# Altium schematic sheet fpga_vq100.SchDoc
size A; SheetNumber: 2; SheetTotal: 2
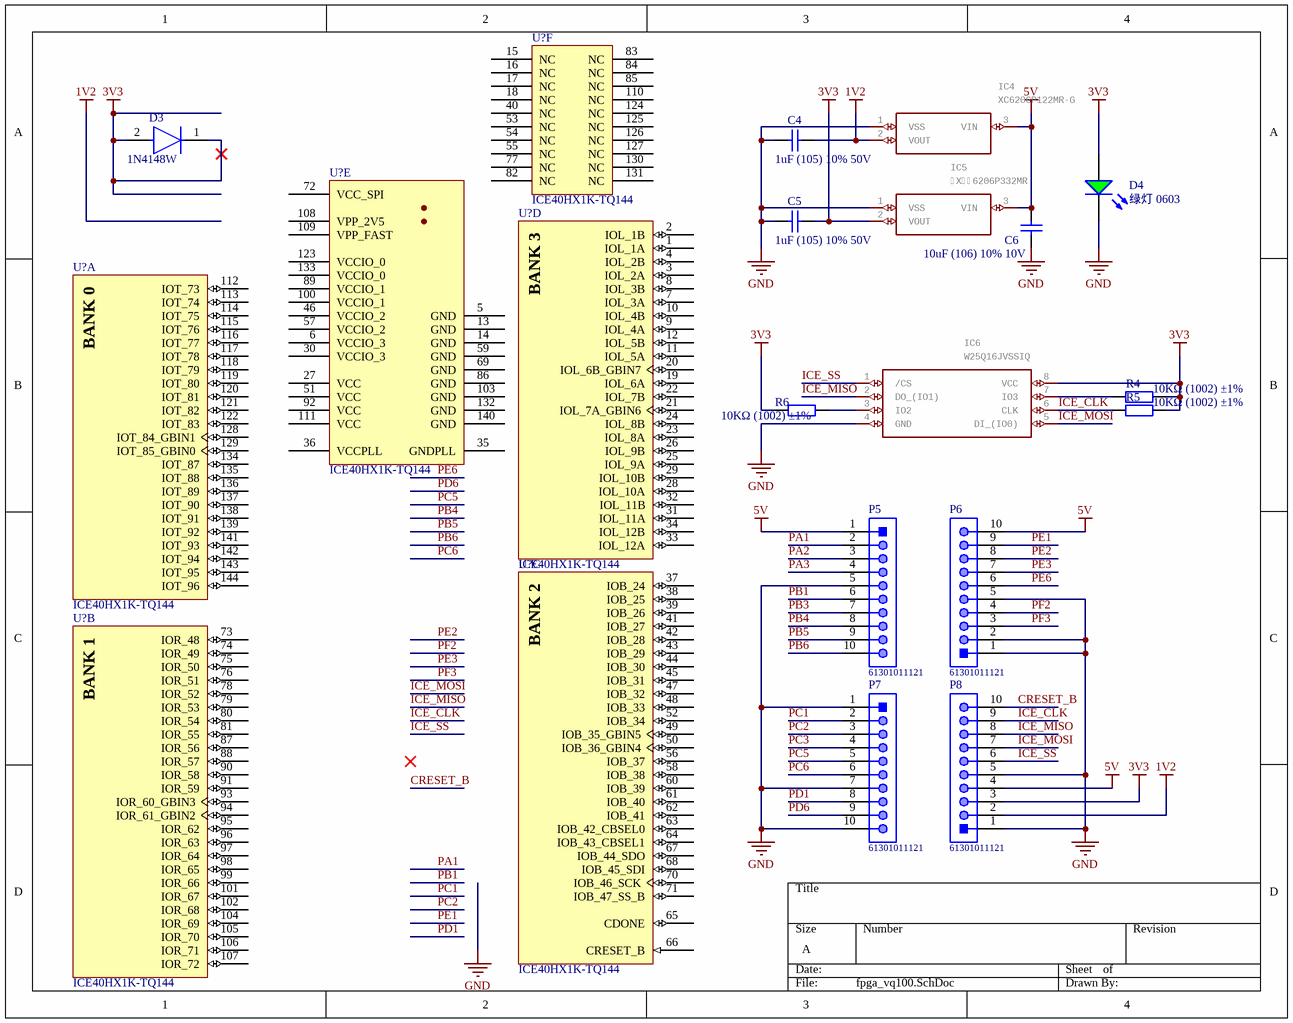
[diagram p0: fpga_vq100.SchDoc]

## Parts
(Parts that share a designator on the sheet are numbered #1, #2 ... from top to bottom, then left to right.)
C4  1uF (105) 10% 50V  [0603_C]
C5  1uF (105) 10% 50V  [0603_C]
C6  10uF (106) 10% 10V  [0603_C]
D3  1N4148W  [FP-SOD123-MFG]
D4  绿灯 0603  [0603_LED_S1]
IC4  XC6206P122MR-G  [SOT95P280X130-3N]
IC5  X6206P332MR  [SOT95P280X130-3N]
IC6  W25Q16JVSSIQ  [SOIC127P790X216-8N]
P5  61301011121  [61301011121]
P6  61301011121  [61301011121]
P7  61301011121  [61301011121]
P8  61301011121  [61301011121]
R4  10KΩ (1002) ±1%  [0603_R]
R5  10KΩ (1002) ±1%  [0603_R]
R6  10KΩ (1002) ±1%  [0603_R]
U?#1  ICE40HX1K-TQ144  [LATC-TQFP-144_L]  (part F of 6)
U?#2  ICE40HX1K-TQ144  [LATC-TQFP-144_L]  (part E of 6)
U?#3  ICE40HX1K-TQ144  [LATC-TQFP-144_L]  (part D of 6)
U?#4  ICE40HX1K-TQ144  [LATC-TQFP-144_L]  (part A of 6)
U?#5  ICE40HX1K-TQ144  [LATC-TQFP-144_L]  (part C of 6)
U?#6  ICE40HX1K-TQ144  [LATC-TQFP-144_L]  (part B of 6)

## Nets
1V2: C4.1 IC4.2(VOUT) P8.2
3V3: C5.1 D3.1(C) D3.2(A) D4.A IC5.2(VOUT) IC6.8(VCC) P8.3 R4.2 R5.2 R6.1
5V: C6.1 IC4.3(VIN) IC5.3(VIN) P5.1 P6.10 P8.4
GND: C4.2 C5.2 C6.2 D4.K IC4.1(VSS) IC5.1(VSS) IC6.4(GND) P5.5 P6.1 P6.2 P6.5 P7.1 P7.7 P7.10 P8.1 P8.5
CRESET_B: P8.10
ICE_CLK: IC6.6(CLK) P8.9 R5.1
ICE_MISO: IC6.2(DO_(IO1)) P8.8
ICE_MOSI: IC6.5(DI_(IO0)) P8.7
ICE_SS: IC6.1(/CS) P8.6
PA1: P5.2
PA2: P5.3
PA3: P5.4
PB1: P5.6
PB3: P5.7
PB4: P5.8
PB5: P5.9
PB6: P5.10
PC1: P7.2
PC2: P7.3
PC3: P7.4
PC5: P7.5
PC6: P7.6
PD1: P7.8
PD6: P7.9
PE1: P6.9
PE2: P6.8
PE3: P6.7
PE6: P6.6
PF2: P6.4
PF3: P6.3
NetIC6_3: IC6.3(IO2) R6.2
NetIC6_7: IC6.7(IO3) R4.1

Not connected (* = marked no-connect by the designer): U?#1 15(NC) 16(NC) 17(NC) 18(NC) 40(NC) 53(NC) 54(NC) 55(NC) 77(NC) 82(NC) 83(NC) 84(NC) 85(NC) 110(NC) 124(NC) 125(NC) 126(NC) 127(NC) 130(NC) 131(NC); U?#2 5(GND) 6(VCCIO_3) 13(GND) 14(GND) 27(VCC) 30(VCCIO_3) 35(GNDPLL) 36(VCCPLL) 46(VCCIO_2) 51(VCC) 57(VCCIO_2) 59(GND) 69(GND) 72(VCC_SPI) 86(GND) 89(VCCIO_1) 92(VCC) 100(VCCIO_1) 103(GND) 108(VPP_2V5) 109(VPP_FAST) 111(VCC) 123(VCCIO_0) 132(GND) 133(VCCIO_0) 140(GND); U?#3 1(IOL_1A) 2(IOL_1B) 3(IOL_2A) 4(IOL_2B) 7(IOL_3A) 8(IOL_3B) 9(IOL_4A) 10(IOL_4B) 11(IOL_5A) 12(IOL_5B) 19(IOL_6A) 20(IOL_6B_GBIN7) 21(IOL_7A_GBIN6) 22(IOL_7B) 23(IOL_8A) 24(IOL_8B) 25(IOL_9A) 26(IOL_9B) 28(IOL_10A) 29(IOL_10B) 31(IOL_11A) 32(IOL_11B) 33(IOL_12A) 34(IOL_12B); U?#4 112(IOT_73) 113(IOT_74) 114(IOT_75) 115(IOT_76) 116(IOT_77) 117(IOT_78) 118(IOT_79) 119(IOT_80) 120(IOT_81) 121(IOT_82) 122(IOT_83) 128(IOT_84_GBIN1) 129(IOT_85_GBIN0) 134(IOT_87) 135(IOT_88) 136(IOT_89) 137(IOT_90) 138(IOT_91) 139(IOT_92) 141(IOT_93) 142(IOT_94) 143(IOT_95) 144(IOT_96); U?#5 37(IOB_24) 38(IOB_25) 39(IOB_26) 41(IOB_27) 42(IOB_28) 43(IOB_29) 44(IOB_30) 45(IOB_31) 47(IOB_32) 48(IOB_33) 49(IOB_35_GBIN5) 50(IOB_36_GBIN4) 52(IOB_34) 56(IOB_37) 58(IOB_38) 60(IOB_39) 61(IOB_40) 62(IOB_41) 63(IOB_42_CBSEL0) 64(IOB_43_CBSEL1) 65(CDONE) 66(CRESET_B) 67(IOB_44_SDO) 68(IOB_45_SDI) 70(IOB_46_SCK) 71(IOB_47_SS_B); U?#6 73(IOR_48) 74(IOR_49) 75(IOR_50) 76(IOR_51) 78(IOR_52) 79(IOR_53) 80(IOR_54) 81(IOR_55) 87(IOR_56) 88(IOR_57) 90(IOR_58) 91(IOR_59) 93(IOR_60_GBIN3) 94(IOR_61_GBIN2) 95(IOR_62) 96(IOR_63) 97(IOR_64) 98(IOR_65) 99(IOR_66) 101(IOR_67) 102(IOR_68) 104(IOR_69) 105(IOR_70) 106(IOR_71) 107(IOR_72)

## Notes on the sheet
- (in symbol CMP-0962-00009-1, part A) BANK 0
- (in symbol CMP-0962-00009-1, part B) BANK 1
- (in symbol CMP-0962-00009-1, part C) BANK 2
- (in symbol CMP-0962-00009-1, part D) BANK 3

## Library data of the parts
C4 C5 = 0603 1uF (105) 10% 50V: 贴片电容; ComponentLink1Description: 供应商链接; ComponentLink1URL: http://www.szlcsc.com/product/details_16531.html; Package: 0603; Supplier: LC; SuppliersPartNumber: C15849
C6 = 0603 10uF (106) 10% 10V: 贴片电容; ComponentLink1Description: 供应商链接; ComponentLink1URL: http://www.szlcsc.com/product/details_20411.html; Package: 0603; Supplier: LC; SuppliersPartNumber: C19702
D3 = CMP-12791-000005-1: DIODE GEN PURP 100V 150MA SOD123; Manufacturer: Diodes Inc.; Manufacturer Part Number: 1N4148W-13-F; Capacitance: 2pF; Forward Current: 300mA; Max Junction Temp: +150°C; Value: 2pF; Standoff Height: 0mm; Peak Reverse Current: 1uA; Max Surge Forward Current: 1A; Category: Diode; Height: 1.45mm; ComponentLink2URL: https://upverter.com/datasheet/628e7d6fee5901eee6eef4567d1c3569f2cd3cde.pdf; Lead Free: Yes; ComponentLink2Description: Datasheet; Octopart: https://octopart.com/1n4148w-13-f-diodes+inc.-2359612; Temperature Range High: +150°C; Device Class L2: Diodes; Digikey Description: DIODE GEN PURP 100V 150MA SOD123; Reverse Voltage: 100V; Temperature Range Low: -65°C; Device Class L1: Discrete Semiconductors; Package: SOD123; RoHS: TRUE; Footprint Url: https://www.diodes.com/assets/Package-Files/SOD123.pdf; Automotive: No; Max Repetitive Reverse Voltage: 100V; Mouser Description: 1N4148W Series 2 A 100 V 400 mW Surface Mount Fast Switching Diode - SOD-123; Temperature: -65°C to +150°C; Device Class L3: Rectifier Diodes
D4 = 0603 绿灯: 发光二极管; ComponentLink1Description: 供应商链接; ComponentLink1URL: http://www.szlcsc.com/product/details_73152.html; Package: 0603; Supplier: LC; SuppliersPartNumber: C72043
IC4 = XC6206P122MR-G: Manufacturer_Name: Torex; GateName_1: G$1; SymbolName_1: XC6206P122MR-G; LibraryName: XC6206P122MR-G; DeviceSetName: XC6206P122MR-G; Package: SOT95P280X130-3N; Manufacturer_Part_Number: XC6206P122MR-G; Mouser_Part_Number: 865-XC6206P122MR-G; Mouser_Price-Stock: https://www.mouser.co.uk/ProductDetail/Torex-Semiconductor/XC6206P122MR-G?qs=AsjdqWjXhJ%2F35%2FU%2FZk2JYg%3D%3D; Height: 1.3mm
IC5 = XC6206P332MR: Manufacturer_Name: Torex; GateName_1: G$1; SymbolName_1: XC6206P332MR; LibraryName: XC6206P332MR; DeviceSetName: XC6206P332MR; Package: SOT95P280X130-3N; Manufacturer_Part_Number: XC6206P332MR; Height: 1.3mm
IC6 = W25Q16JVSSIQ: Manufacturer_Name: Winbond; GateName_1: G$1; SymbolName_1: W25Q16JVSSIQ; LibraryName: W25Q16JVSSIQ; DeviceSetName: W25Q16JVSSIQ; Package: SOIC127P790X216-8N; Manufacturer_Part_Number: W25Q16JVSSIQ; Mouser_Part_Number: 454-W25Q16JVSSIQ; Mouser_Price-Stock: https://www.mouser.co.uk/ProductDetail/Winbond/W25Q16JVSSIQ?qs=qSfuJ%252Bfl%2Fd46L%2F1QrQC%2Fog%3D%3D; Arrow_Part_Number: W25Q16JVSSIQ; Arrow_Price-Stock: https://www.arrow.com/en/products/w25q16jvssiq/winbond-electronics; Height: 2.16mm
P5-P8 = CMP-1502-01082-1: THT Vertical Pin Header WR-PHD, Pitch 2.54 mm, Single Row, 10 pins; Manufacturer: Wurth Elektronik; Contact Resistance: 20mOhm; Rated Current: 3A; Pitch: 2.54mm; Gender: Male; Pin Number: 10; Working Voltage: 250VAC; Withstanding Voltage: 500VAC; Manufacturer URL: http://www.we-online.de; Operating Temperature: -40to105degC; Datasheet URL: https://katalog.we-online.de/em/datasheet/6130xx11121.pdf; Row Number: Single; Orientation: Vertical; Part Number: 61301011121; Packaging: Bag; Package Reference: 61301011121; Mounting Technology: THT; Publisher: WurthElektronik
R4-R6 = 0603 10KΩ (1002) 1%: 贴片电阻; ComponentLink1Description: 供应商链接; ComponentLink1URL: http://www.szlcsc.com/product/details_26547.html; Package: 0603; Supplier: LC; SuppliersPartNumber: C25804
U?#1-U?#6 = CMP-0962-00009-1: iCE40 HX1K Series FPGA Family, 1280 Logic Cells, 1.2 V Core, 64 K Embedded RAM Bits, 144-pin TQFP, Pb-Free, Tray; Manufacturer: Lattice Semiconductor; Embedded RAM Bits: 64K; Logic Cells: 1280; Phase-Locked Loops: 1; Supply Voltage: 1.2V; Mounting Technology: Surface Mount; ComponentLink3URL: http://www.latticesemi.com/lit/docs/package/pkg.pdf; ComponentLink1URL: http://www.latticesemi.com/en; ComponentLink2Description: Datasheet; RoHS: TRUE; ComponentLink2URL: http://www.latticesemi.com/~/media/Documents/DataSheets/iCE/iCE40LPHXFamilyDataSheet.pdf; PackageVersion: Rev. 03.9, 02/2013; ComponentLink1Description: Manufacturer URL; PartNumber: ICE40HX1K-TQ144; DatasheetVersion: Rev. 02.9; PackageReference: TQFP-144; PackageDescription: 144-Pin Thin Quad Flat Package, Body 20 x 20 mm, Pitch 0.5 mm; Packing: Tray; ComponentLink3Description: Package Specification